# Altium schematic sheet UWB3000.SchDoc
size A; SheetNumber: 3; SheetTotal: 4
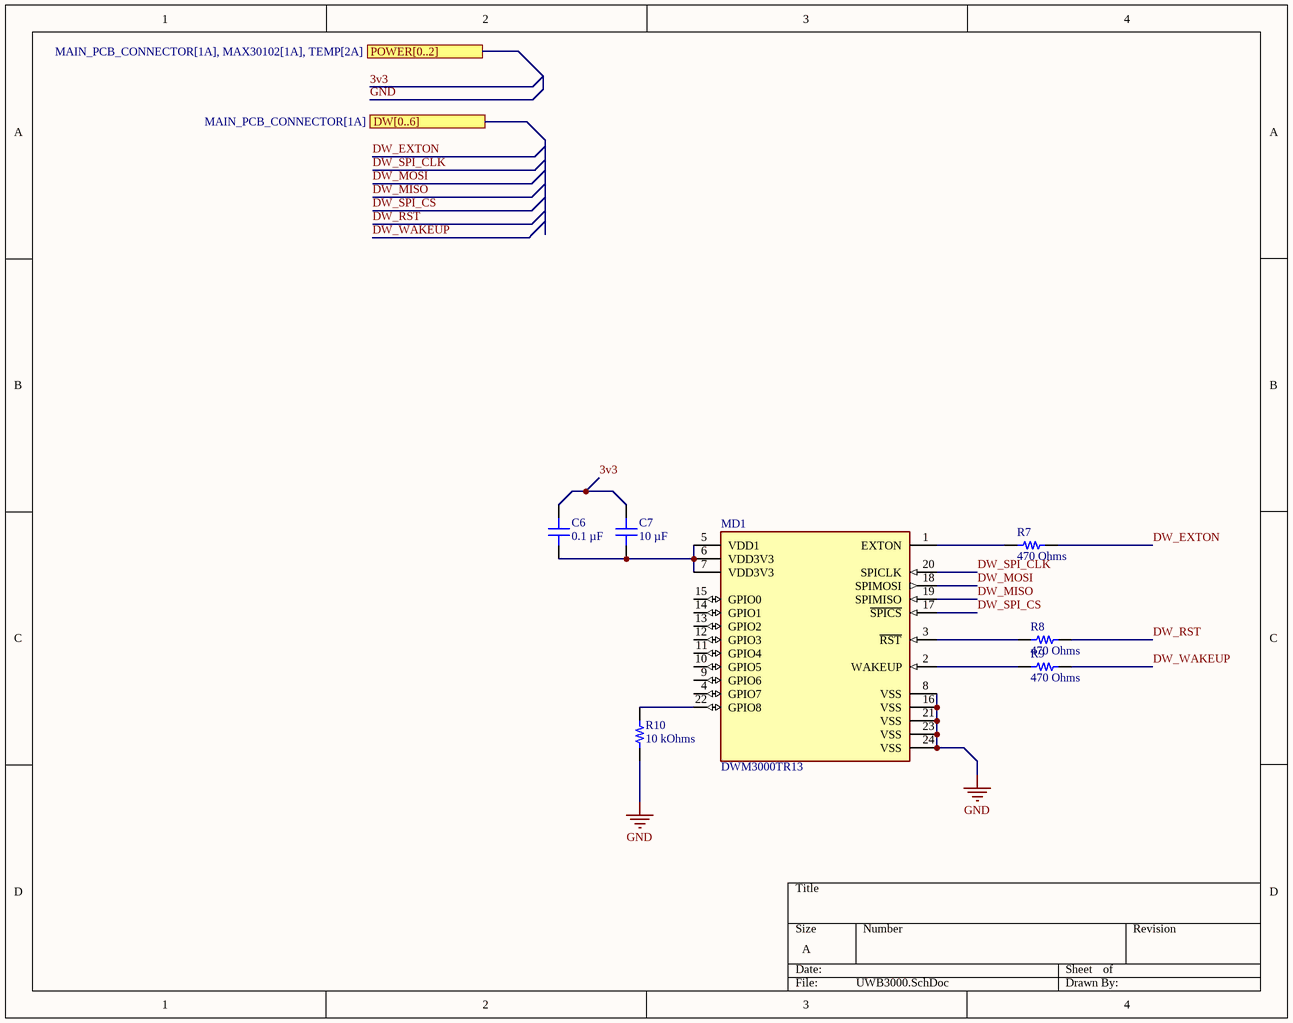
[diagram p0: UWB3000.SchDoc]

## Parts
C6  Capacitance: 0.1 µF  [CAP 0402_1005]
C7  Capacitance: 10 µF  [CAP 0402_1005]
MD1  DWM3000TR13  [FP-DWM3000TR13-MFG]
R7  470 Ohms  [RES 0402_1005]
R8  470 Ohms  [RES 0402_1005]
R9  470 Ohms  [RES 0402_1005]
R10  10 kOhms  [RES 0402_1005]

## Ports
DW[0..6] (see MAIN_PCB_CONNECTOR[1A]), POWER[0..2] (see MAIN_PCB_CONNECTOR[1A], MAX30102[1A], TEMP[2A])

## Nets
GND: MD1.8(VSS) MD1.16(VSS) MD1.21(VSS) MD1.23(VSS) MD1.24(VSS) R10.1
3v3: C6.2 C7.2
DW_EXTON: R7.2
DW_MISO: MD1.19(SPIMISO)
DW_MOSI: MD1.18(SPIMOSI)
DW_RST: R8.2
DW_SPI_CLK: MD1.20(SPICLK)
DW_SPI_CS: MD1.17(~{SPICS})
DW_WAKEUP: R9.2
NetC6_1: C6.1 C7.1 MD1.5(VDD1) MD1.6(VDD3V3) MD1.7(VDD3V3)
NetMD1_1: MD1.1(EXTON) R7.1
NetMD1_2: MD1.2(WAKEUP) R9.1
NetMD1_3: MD1.3(~{RST}) R8.1
NetMD1_22: MD1.22(GPIO8) R10.2

Not connected (* = marked no-connect by the designer): MD1 4(GPIO7) 9(GPIO6) 10(GPIO5) 11(GPIO4) 12(GPIO3) 13(GPIO2) 14(GPIO1) 15(GPIO0)

## Notes on the sheet
- Labels drawn without touching a wire or pin: DW_MISO, DW_MOSI, DW_RST, DW_SPI_CLK, DW_SPI_CS

## Library data of the parts
C6 = 0402B104J160CT: CAP CER 0.1UF 16V X7R 0402; Manufacturer: Samsung Electro-Mechanics; MFR.Part #: CL05B104KO5NNNC; JLCPCB Part #: C1525
C7 = 0402X106M6R3CT: CAP CER 10UF 6.3V X5R 0402; Manufacturer: Samsung Electro-Mechanics; MFR.Part #: CL05A106MQ5NUNC; JLCPCB Part #: C15525
MD1 = CMP-231853-000002-1: DWM3000 module Freq: 7.9872 GHz 6.8Mbps SPI 2.5-3.6V 8 GPIO's; Manufacturer: Qorvo; MFR.Part #: DWM3000TR13; JLCPCB Part #: C5299931
R7-R9 = TNPW0402470RBYEP: RES 470 OHM 0.1% 1/16W 0402; Manufacturer: UNI-ROYAL(Uniroyal Elec); MFR.Part #: 0402WGF4700TCE; Value: 470 Ohms; ComponentLink1Description: Datasheet; ComponentLink1URL: http://www.vishay.com/docs/28758/tnpw_e3.pdf; ComponentLink2Description: DigiKey Link; ComponentLink2URL: http://digikey.com/product-detail/en/vishay-dale/TNPW0402470RBYEP/541-9810-1-ND/9562435; JLCPCB Part #: C25117
R10 = RP73PF1E10KBTD: RES 10K OHM 0.1% 1/10W 0402; Manufacturer: Ever Ohms Tech; MFR.Part #: TR0402D10K0Q1025Z; Value: 10 kOhms; ComponentLink1Description: Datasheet; ComponentLink1URL: https://www.te.com/commerce/DocumentDelivery/DDEController?Action=srchrtrv&DocNm=1773272&DocType=DS&DocLang=English; ComponentLink2Description: DigiKey Link; ComponentLink2URL: https://www.digikey.com/en/products/detail/te-connectivity-passive-product/RP73PF1E10KBTD/8260957; JLCPCB Part #: C149898